# Altium schematic sheet CVC_channel.SchDoc
size 209 x 296 mm; PageSetup: Record=PageOptions|CenterHorizontal=True|CenterVertical=True|PrintScale=0.99|XCorrection=1.00|YCorrection=1.00|PrintKind=1|BorderSize=5000000|LeftOffset=0|BottomOffset=0|Orientation=1|PaperLength=1000|PaperWidth=1000|Scale=100|PaperSource=7|PrintQuality=600|MediaType=1|DitherType=10|PaperKind=A4|PrintScaleMode=1
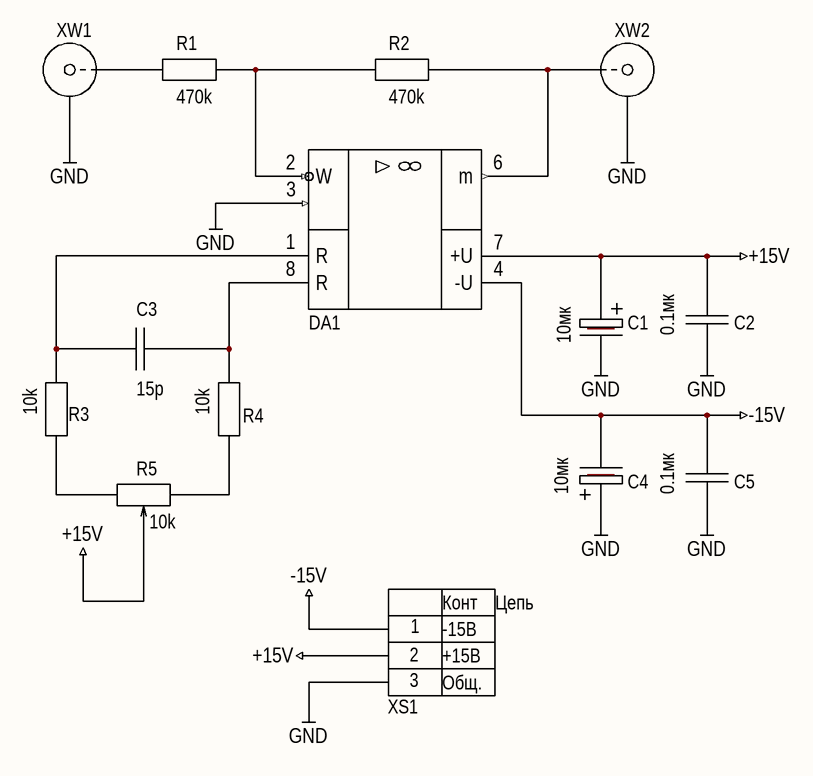
[diagram p0: CVC_channel.SchDoc]

## Parts
C1  label: 10мк  [B]  (hidden comment: Tantal B case)
C2  label: 0.1мк  [CC2012-0805]  (hidden comment: Конденсатор ЧИП)
C3  label: 15p  [CC2012-0805]  (hidden comment: Конденсатор ЧИП)
C4  label: 10мк  [B]  (hidden comment: Tantal B case)
C5  label: 0.1мк  [CC2012-0805]  (hidden comment: Конденсатор ЧИП)
DA1  KR544UD1A  [DIP-8]  (value not drawn)
R1  Label: 470k  [CR2012-0805]  (hidden comment: резистор чип)
R2  label: 470k  [CR2012-0805]  (hidden comment: резистор чип)
R3  label: 10k  [CR2012-0805]  (hidden comment: резистор чип)
R4  label: 10k  [CR2012-0805]  (hidden comment: резистор чип)
R5  label: 10k  [3296W]  (hidden comment: Trimming Potentiometer)
XS1  Клемма 15EDGRC-3.81-03P (XY2500R)  [15EDGRC-3.81-03P]  (value not drawn)
XW1  BNC  [BNC_RA CON]  (value not drawn)
XW2  BNC  [BNC_RA CON]  (value not drawn)

## Nets
+15V: C1.2(+) C2.1 DA1.7(+U) R5.2 XS1.2
-15V: C4.1(-) C5.2 DA1.4(-U) XS1.1
GND: C1.1(-) C2.2 C4.2(+) C5.1 DA1.3 XS1.3 XW1.2(Y) XW2.2(Y)
NetC3_1: C3.1 DA1.1(R) R3.2
NetC3_2: C3.2 DA1.8(R) R4.2
NetDA1_2: DA1.2(W) R1.2 R2.1
NetDA1_6: DA1.6(m) R2.2 XW2.1(X)
NetR1_1: R1.1 XW1.1(X)
NetR3_1: R3.1 R5.3
NetR4_1: R4.1 R5.1

## Notes on the sheet
- (near XS1) 2
- (near XS1) 1
- (near XS1) -15B
- (near XS1) +15B
- (near XS1) 3
- (near XS1) Общ.
- ИГУ.000000.001 Э3
- Перв. примен.
- Справ. №
- Подп. и дата
- Инв. № дубл.
- Взам. инв. №
- Изм.
- Лист
- № докум.
- Подп.
- Дата
- ток-напряжение
- Преобразователь
- Лит.
- Масса
- Масштаб
- Разраб.
- Пров.
- Т.контр.
- Лисун И.В.
- Скудаев Ю.Д.
- принципиальная
- Схема электрическая
- Листов
- Инв. № подл.
- Н.контр.
- Утв.
- Дроков В.Г.
- Копировал:
- Формат А4
- (in symbol Клемма 15EDGRC-3.81-03P (XY2500R)) Конт; Цепь

## Library data of the parts
C1 C4 = Tantal B case: Конденсатор танталовый LowESR; name: Тантал. ЧИП B case (B45197A); value: 10 мкФ; dopusk: ±20%; type: конденсаторы; napr: 16 В; codegr: 1002060122; enter: *
C2 C5 = Конденсатор ЧИП: Чип конденсатор; name: ЧИП-0805-X7R; value: 0.1 мкФ; dopusk: ±10%; type: конденсаторы; codegr: 1002060122; enter: *
C3 = Конденсатор ЧИП: Чип конденсатор; name: ЧИП-0805-X7R; value: 15 пФ; dopusk: ±10%; type: конденсаторы; codegr: 1002060122; enter: *
R1 R2 = Резистор ЧИП: name: ЧИП-0805; value: 470 кОм; dopusk: ±5%; codegr: 100206060405; type: резисторы; enter: *
R3 R4 = Резистор ЧИП: name: ЧИП-0805; value: 10 кОм; dopusk: ±5%; codegr: 100206060405; type: резисторы; enter: *
R5 = Резистор переменный 3296W: name: 3296; value: 10 кОм; type: резисторы
XW1 XW2 = BNC: BNC Elbow Connector; name: Разъем BNC (гнездо); LatestRevisionDate: 17-Jul-2002; LatestRevisionNote: Re-released for DXP Platform.; Publisher: Altium Limited; type: коннекторы
DA1 = KR544UD1A: name: KR544UD1A; type: микросхемы аналоговые
XS1 = Клемма 15EDGRC-3.81-03P (XY2500R): name: Клемма 15EDGRC-3.81-03P; type: коннекторы